# EAGLE design panda_debug (EAGLE 9.0.0)
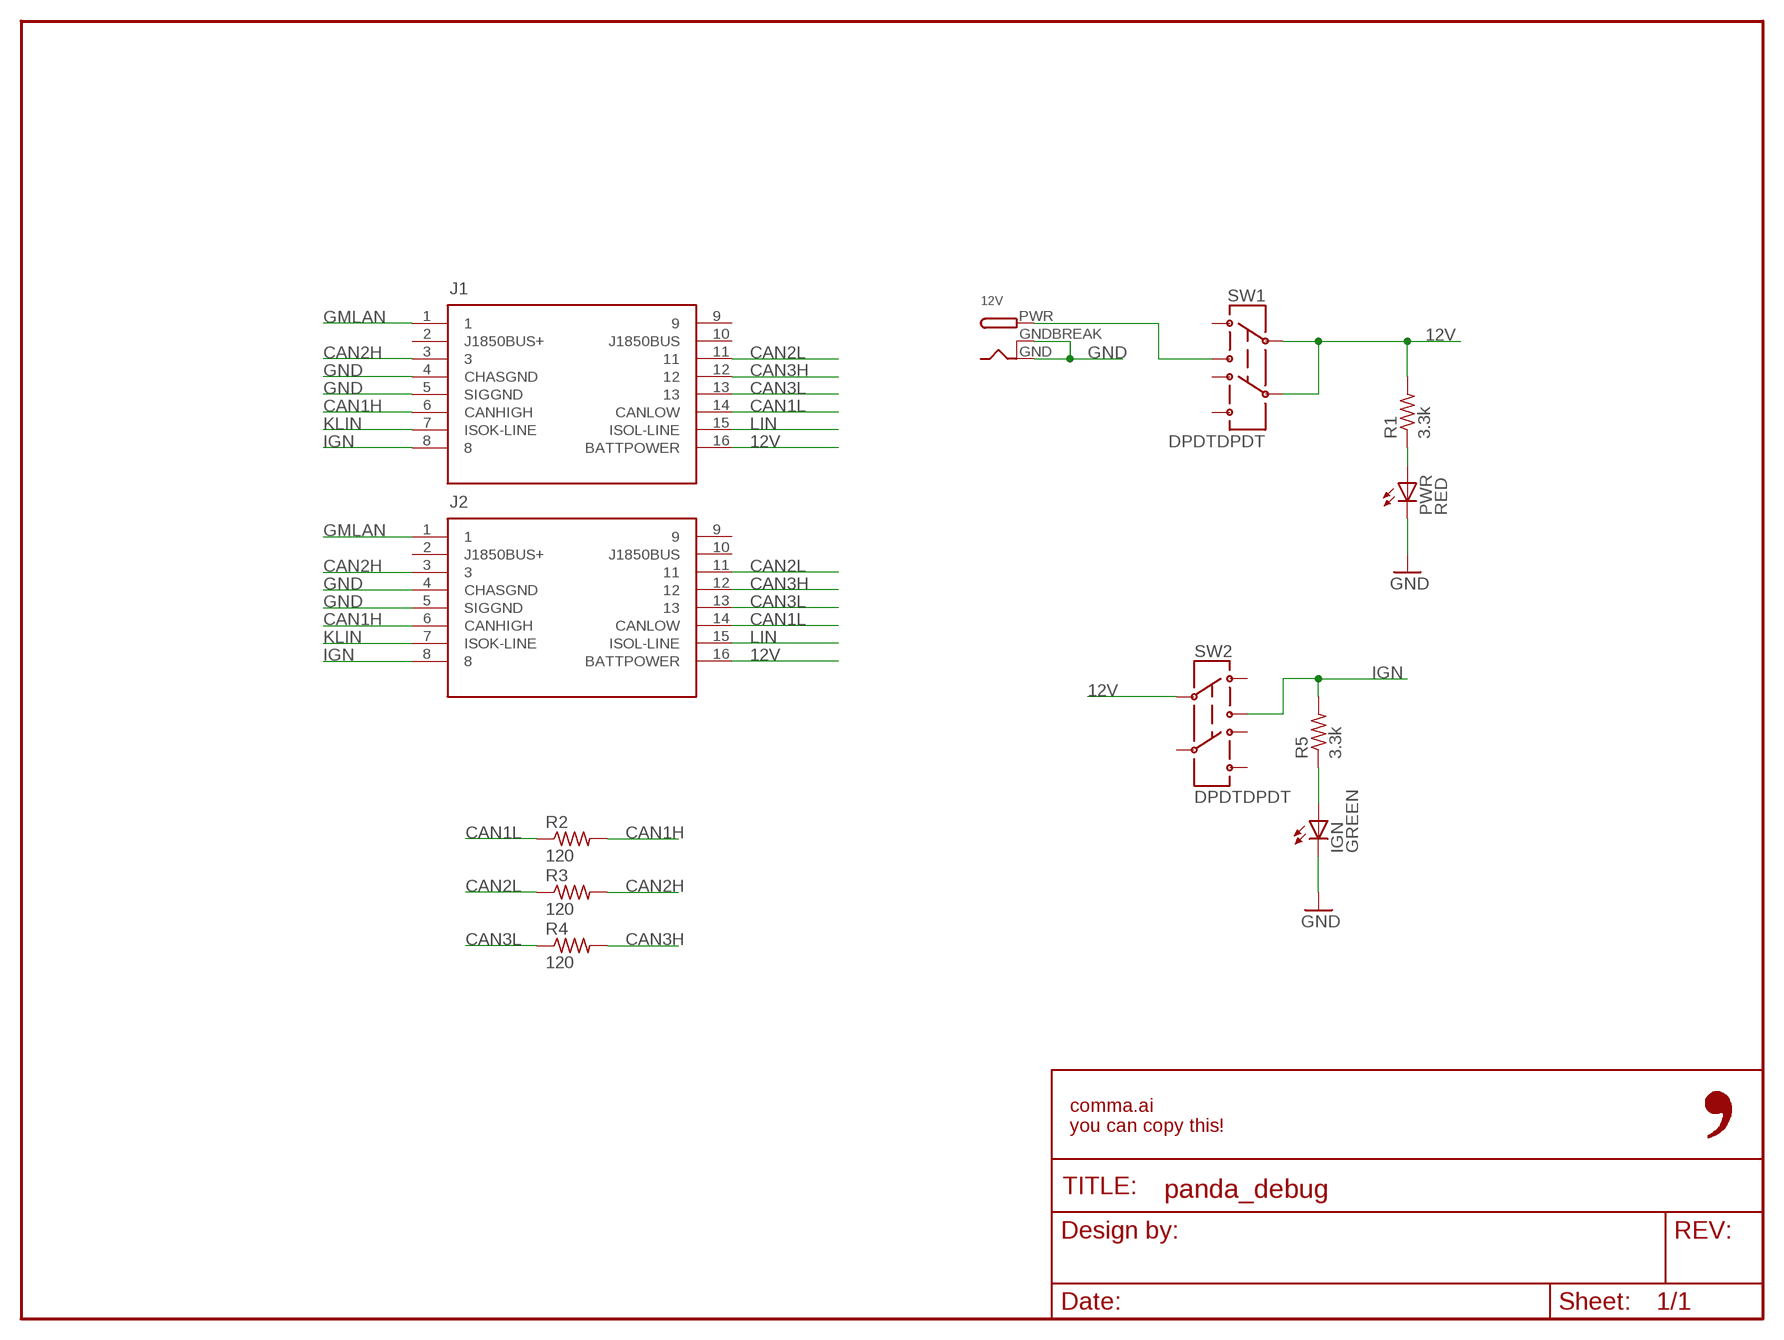
[diagram p0: schematic, sheet 1]

## Parts
12V  DCBARRELPTH  [DCJACK_2MM_PTH]
FRAME1  FRAME-LETTER-OPENNO_PACKAGE  [DUMMY]
IGN  GREEN  LEDCHIPLED_0805  [CHIPLED_0805]
J1  OBDII-FEMALEFEMALE  [OBDII-FEMALE]
J2  OBDII-FEMALEFEMALE  [OBDII-FEMALE]
PWR  RED  LEDCHIPLED_0805  [CHIPLED_0805]
R1  3.3k  R0603  [0603-R]
R2  120  R0603  [0603-R]
R3  120  R0603  [0603-R]
R4  120  R0603  [0603-R]
R5  3.3k  R0603  [0603-R]
SW1  DPDTDPDT  [AYZ0202]
SW2  DPDTDPDT  [AYZ0202]

## Nets
12V: J1.16(BATTPOWER) J2.16(BATTPOWER) R1.2 SW1.2 SW1.5 SW2.2
CAN1H: J1.6(CANHIGH) J2.6(CANHIGH) R2.2
CAN1L: J1.14(CANLOW) J2.14(CANLOW) R2.1
CAN2H: J1.3 J2.3 R3.2
CAN2L: J1.11 J2.11 R3.1
CAN3H: J1.12 J2.12 R4.2
CAN3L: J1.13 J2.13 R4.1
GMLAN: J1.1 J2.1
GND: 12V.GND 12V.GNDBREAK IGN.C J1.4(CHASGND) J1.5(SIGGND) J2.4(CHASGND) J2.5(SIGGND) PWR.C
IGN: J1.8 J2.8 R5.2 SW2.3
KLIN: J1.7(ISOK-LINE) J2.7(ISOK-LINE)
LIN: J1.15(ISOL-LINE) J2.15(ISOL-LINE)
N$1: 12V.PWR SW1.3
N$2: PWR.A R1.1
N$3: IGN.A R5.1
Unconnected: J1.2(J1850BUS+) J1.9 J1.10(J1850BUS) J2.2(J1850BUS+) J2.9 J2.10(J1850BUS) SW1.1 SW1.4 SW1.6 SW2.1 SW2.4 SW2.5 SW2.6

## Library data of the parts
12V = adafruit:DCBARREL: 2.0mm DC Barrel Jack DCJACK_2MM_PTH - Through Hole Jack (4UConnector: 05537)
FRAME1 = comma.ai:FRAME-LETTER-OPEN: Schematic Frame - Letter Standard 8.5x11 US Letter frame; DESIGNER: Nobody; VERSION: v01
IGN PWR = adafruit:LED: LED OSRAM: - CHIPLED LG R971, LG N971, LY N971, LG Q971, LY Q971, LO R971, LY R971 LH N974, LH R974 LS Q976, LO Q976, LY Q976 LO Q996 - Hyper CHIPLED LW Q18S LB Q993, LB Q99A, LB R99A - SideLED LS A670, LO A670, LY A670, LG A670, LP A670 LB A673, LV A673, LT A673, LW A673 LH A674 LY A675 LS A676, LA A676, LO A676, LY A676, LW A676 LS A679, LY A679, LG A679 - Hyper Micro SIDELED® LS Y876, LA Y876, LO Y876, LY Y876 LT Y87S - SmartLED LW L88C, LW L88S LB L89C, LB L89S, LG L890 LS L89K, LO L89K, LY L89K LS L896, LA L896, LO L896, LY L896 - TOPLED LS T670, LO T670, LY T670, LG T670, LP T670 LSG T670, LSP T670, LSY T670, LOP T670, LYG T670 LG T671, LOG T671, LSG T671 LB T673, LV T673, LT T673, LW T673 LH T674 LS T676, LA T676, LO T676, LY T676, LB T676, LH T676, LSB T676, LW T676 LB T67C, LV T67C, LT T67C, LS T67K, LO T67K, LY T67K, LW E67C LS E67B, LA E67B, LO E67B, LY E67B, LB E67C, LV E67C, LT E67C LW T67C LS T679, LY T679, LG T679 LS T770, LO T770, LY T770, LG T770, LP T770 LB T773, LV T773, LT T773, LW T773 LH T774 LS E675, LA E675, LY E675, LS T675 LS T776, LA T776, LO T776, LY T776, LB T776 LHGB T686 LT T68C, LB T68C - Hyper Mini TOPLED® LB M676 - Mini TOPLED Santana® LG M470 LS M47K, LO M47K, LY M47K Source: http://www.osram.convergy.de/
J1 J2 = comma.ai:OBDII-FEMALE
R1-R5 = comma.ai:R
SW1 SW2 = comma.ai:DPDT

## Board
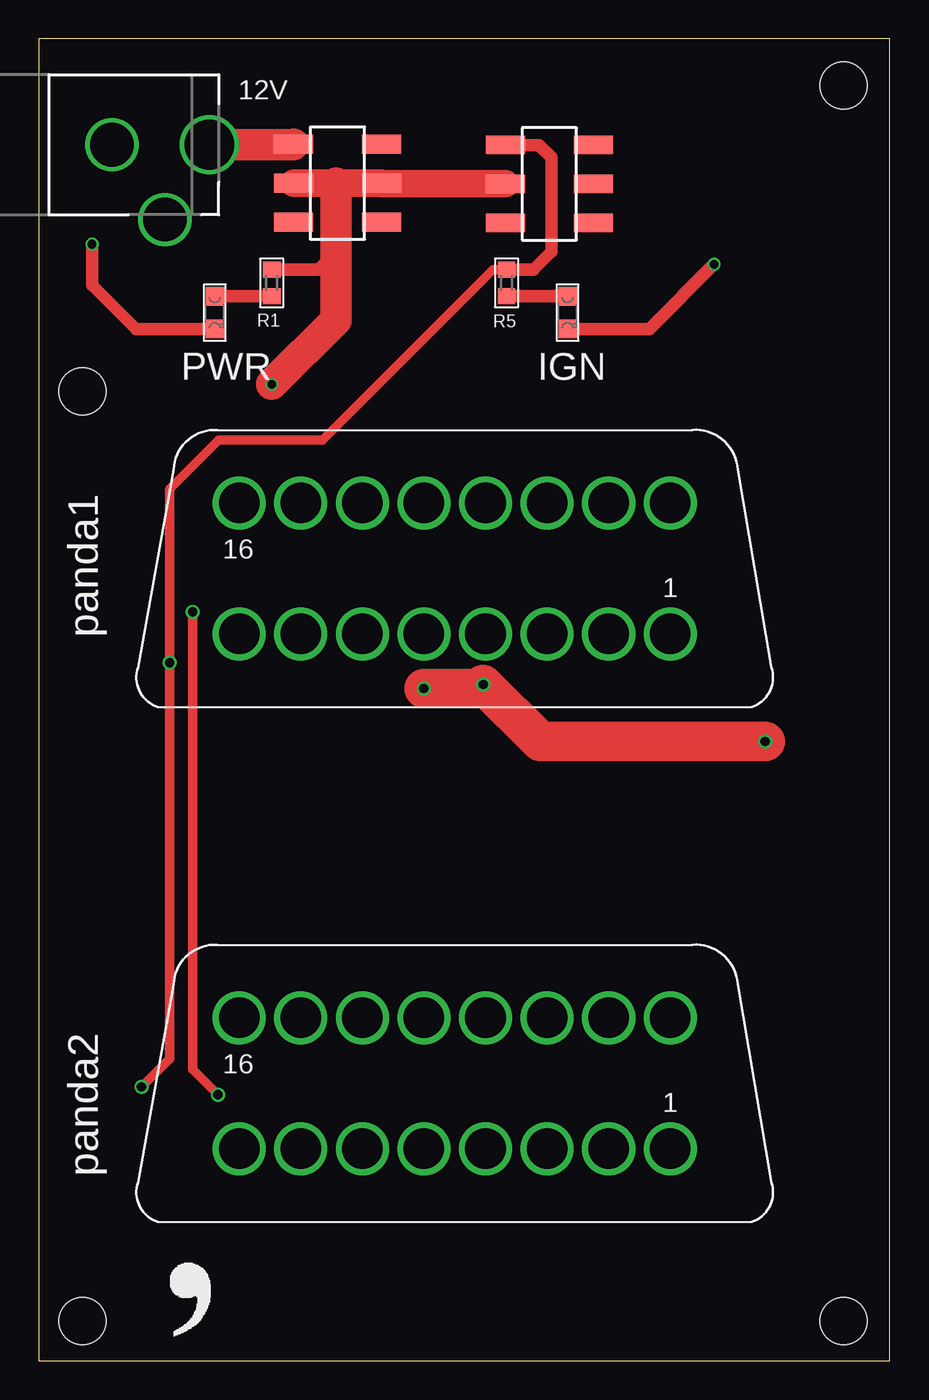
[diagram p1: board, top side]
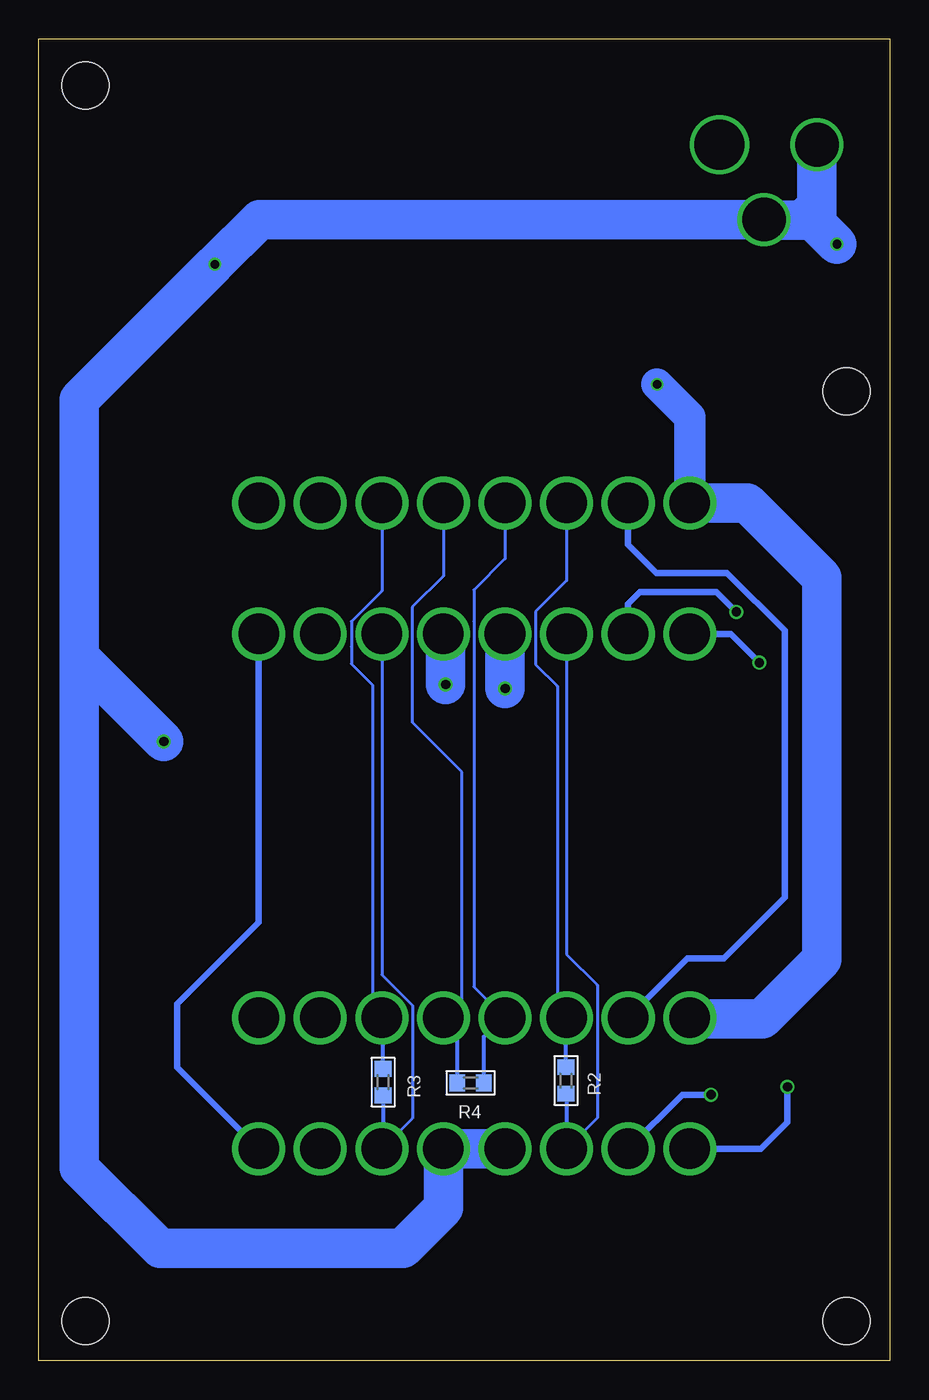
[diagram p2: board, bottom side, seen from below]

Size 54.59 x 84.76 mm. Coordinates in mm from the lower left corner, seen from the top.
Outline: 0,0 54.59,0 54.59,84.76 0,84.76 0,0
Copper layers (1*16): Top 0.035mm / dielectric 1.5mm / Bottom 0.035mm
Design rules "default *": minimum track width 6mil, minimum drill 0.35mm, track to track 6mil, track to pad 6mil, pad to pad 6mil, via to via 6mil, smd to smd 6mil, copper to edge 40mil, drill to drill 6mil, minimum pad ring 4mil, minimum via ring 4mil, stop-mask expansion 4mil, vias tented up to drill 0mil, thermal gap 10mil
Holes 3 mm at 51.61,81.79 51.61,2.54 2.79,2.54 2.79,62.15

### Footprints (pad centres in the part's own frame; a part is rotated, then mirrored left to right if it is on the bottom)
DCJACK_2MM_PTH = drill 2.8: GND 0,7.35; GNDBREAK 4.8,10.75 | drill 3.2: PWR 0,13.6
CHIPLED_0805 = smd 1.2 x 1.2: A 0,-1.05; C 0,1.05
OBDII-FEMALE = drill 2.6 pad 3.4: 1 13.825,-4.2; 2 9.875,-4.2; 3 5.925,-4.2; 4 1.975,-4.2; 5 -1.975,-4.2; 6 -5.925,-4.2; 7 -9.875,-4.2; 8 -13.825,-4.2; 9 13.825,4.2; 10 9.875,4.2; 11 5.925,4.2; 12 1.975,4.2; 13 -1.975,4.2; 14 -5.925,4.2; 15 -9.875,4.2; 16 -13.825,4.2
0603-R = smd 1 x 1.1: 1 -0.85,0; 2 0.85,0
AYZ0202 = smd 1.2 x 2.5: 1 -2.5,2.825; 2 0,2.825; 3 2.5,2.825; 4 -2.5,-2.825; 5 0,-2.825; 6 2.5,-2.825

### Placement (x,y rotation side)
12V  -2.67,77.98 270 top
FRAME1  -11.43,-3.81 0 top  (outside the outline)
IGN  33.91,67.21 180 top
J1  26.67,17.78 0 top
J2  26.67,50.8 0 top
PWR  11.28,67.21 180 top
R1  14.94,69.11 90 top
R2  20.78,17.96 270 bottom
R3  32.51,17.86 270 bottom
R4  26.9,17.81 180 bottom
R5  30,69.11 90 top
SW1  19.15,75.51 90 top
SW2  32.74,75.46 90 top
U$1  [LOGO]  7.75,1.27 0 top

### Tracks (layer width: path | path; a pad name or v marks a point on that pad's centre or on a via)
12V  (via drill 0.55)
  Top 0.813: R1.2 17.89,69.96 19.05,71.12
  Top 1.778: SW1.2 19.05,75.51 SW1.5 22.03,75.46 SW2.2
  Top 2.032: 19.05,75.51 19.05,71.12 19.05,66.73 v14.94,62.61
  Bottom 1.778: J2.16 12.83,55.02 | 12.79,21.92 J1.16
  Bottom 2.032: v14.94,62.61 12.85,60.52 J2.16
  Bottom 2.54: J2.16 9.15,55 4.37,50.22 4.37,25.73 8.18,21.92 12.79,21.92
CAN1H
  Bottom 0.203: J2.6 20.75,26.05 18.77,24.08 18.77,15.55 J1.6
  Bottom 0.254: R2.2 20.75,17.08 J1.6
CAN1L
  Bottom 0.203: J2.14 20.75,50.02 22.73,48.03 22.73,44.65 21.34,43.26 21.34,22.57 20.78,22.01 J1.14
  Bottom 0.254: R2.1 20.78,22.01
CAN2H
  Bottom 0.203: J2.3 32.59,24.74 30.64,22.79 30.64,15.53 32.51,13.66 J1.3
  Bottom 0.254: R3.2 32.51,13.66
CAN2L
  Bottom 0.203: 34.55,45.79 34.55,47.41 32.59,49.36 J2.11 | 34.55,45.79 34.54,45.79 | 34.55,45.79 34.55,44.68 33.2,43.33 33.2,22.58 J1.11
  Bottom 0.254: R3.1 32.51,21.9 J1.11
CAN3H
  Bottom 0.203: 28.6,55.05 J2.12 28.64,50.32 30.66,48.31 30.66,47.43 30.64,47.41 30.64,40.93 27.46,37.74 27.46,23.17 J1.12
  Bottom 0.254: R4.2 27.75,21.08 J1.12
CAN3L
  Bottom 0.203: J2.13 24.7,51.43 26.7,49.43 26.7,47.41 26.69,47.41 26.69,23.98 24.76,22.05 J1.13
  Bottom 0.254: R4.1 26.05,20.76 24.76,22.05
GMLAN
  Bottom 0.406: J2.1 40.49,28.09 45.72,22.86 45.72,18.8 J1.1
GND  (via drill 0.55, 0.55 pad 0.75, 0.6)
  Top 0.813: v3.4,71.6 3.4,68.99 6.23,66.16 PWR.C | IGN.C 39.16,66.16 v43.31,70.31
  Top 2.54: v46.58,39.7 32.16,39.7 v28.5,43.36 28.25,43.1 v24.69,43.1
  Bottom 1.778: 28.5,46.45 J2.4 | 24.71,13.56 J1.5 | v24.7,43.11 v24.69,43.1
  Bottom 2.54: 12V.GND 4.68,74.03 | 4.68,74.03 5.59,73.13 8.03,73.13 12V.GNDBREAK 40.44,73.18 v43.31,70.31 51.99,61.62 51.99,45.11 | 51.99,45.11 v46.58,39.7 | v28.5,43.36 28.5,46.45 | 51.99,45.11 51.99,12.37 46.81,7.19 31.24,7.19 28.64,9.79 J1.4 J1.5 | J2.5 v24.7,43.11 | 4.68,74.03 4.68,72.88 v3.4,71.6
IGN  (via drill 0.6)
  Top 0.61: v6.58,17.55 8.38,19.36 v8.38,44.76 8.38,55.88 11.53,59.03 18.19,59.03 29.12,69.96 R5.2
  Top 0.813: 29.92,70.05 R5.2 31.71,69.96 32.87,71.12 32.87,77.17 32.07,77.96 SW2.3
  Bottom 0.406: v6.58,17.55 6.58,15.27 8.28,13.56 12.83,13.56 J1.8 | J2.8 10.22,46.6 v8.38,44.76
KLIN  (via drill 0.6)
  Top 0.61: v9.86,48.01 9.86,18.67 v11.48,17.04
  Bottom 0.406: v11.48,17.04 13.33,17.04 J1.7 | J2.7 16.8,48.53 16.03,49.3 11.14,49.3 v9.86,48.01
LIN
  Bottom 0.406: J2.15 16.8,52.33 14.99,50.52 10.46,50.52 6.76,46.81 6.76,29.69 10.67,25.78 12.99,25.78 J1.15
N$1
  Top 2.032: 12V.PWR 16.29,77.98 SW1.3
N$2
  Top 0.813: R1.1 PWR.A
N$3
  Top 0.813: R5.1 IGN.A

### Text on the board
tNames: panda1 | panda2